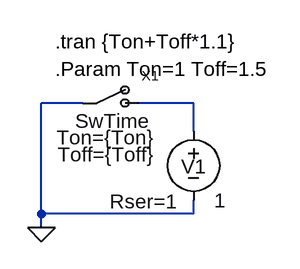
[diagram p0: schematic SwTimeJerTst.asc]
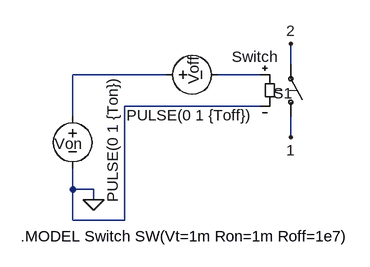
[diagram p1: sub-circuit swtime.asc]
SwTimeJerTst.asc, the LTspice schematic file:
Version 4
SHEET 1 880 680
WIRE 96 240 48 240
WIRE 224 240 160 240
WIRE 224 272 224 240
WIRE 48 368 48 240
WIRE 224 368 224 352
WIRE 224 368 48 368
WIRE 48 384 48 368
FLAG 48 384 0
SYMBOL voltage 224 256 R0
WINDOW 0 -14 57 Left 0
WINDOW 123 0 0 Left 0
WINDOW 39 -97 97 Left 0
SYMATTR InstName V1
SYMATTR SpiceLine Rser=1
SYMATTR Value 1
SYMBOL SwTime 128 240 R0
SYMATTR SpiceLine Ton={Ton}
SYMATTR SpiceLine2 Toff={Toff}
SYMATTR InstName X1
TEXT 64 168 Left 0 !.tran {Ton+Toff*1.1}
TEXT 64 200 Left 0 !.Param Ton=1 Toff=1.5

swtime.asc, the sub-circuit schematic file:
Version 4
SHEET 1 880 1444
WIRE 224 1152 224 1120
WIRE 32 1168 -112 1168
WIRE 176 1168 112 1168
WIRE 176 1216 -32 1216
WIRE -112 1232 -112 1168
WIRE 224 1264 224 1232
WIRE -112 1344 -112 1312
WIRE -80 1344 -112 1344
WIRE -80 1360 -80 1344
WIRE -112 1392 -112 1344
WIRE -32 1392 -32 1216
WIRE -32 1392 -112 1392
FLAG 224 1264 1
FLAG 224 1120 2
FLAG -80 1360 0
SYMBOL voltage -112 1216 R0
WINDOW 3 62 -45 VRight 0
WINDOW 123 0 0 Left 0
WINDOW 39 78 67 Left 0
WINDOW 0 -28 58 Left 0
SYMATTR Value PULSE(0 1 {Ton})
SYMATTR InstName Von
SYMBOL sw 224 1248 M180
WINDOW 0 -27 52 Left 0
WINDOW 3 -91 108 Left 0
SYMATTR InstName S1
SYMATTR Value Switch
SYMBOL voltage 16 1168 M90
WINDOW 3 62 -45 VRight 0
WINDOW 123 0 0 Left 0
WINDOW 39 78 67 Left 0
WINDOW 0 -28 58 Left 0
SYMATTR Value PULSE(0 1 {Toff})
SYMATTR InstName Voff
TEXT -192 1416 Left 0 !.MODEL Switch SW(Vt=1m Ron=1m Roff=1e7)

The netlist it stands for:
* SwTimeJerTst.asc
V1 N001 0 1 Rser=1
XX1 0 N001 swtime params: SwTime Ton={Ton} Toff={Toff}

* block symbol definitions
.subckt swtime 1 2
Von N001 0 PULSE(0 1 {Ton})
S1 1 2 N002 0 Switch
Voff N001 N002 PULSE(0 1 {Toff})
.MODEL Switch SW(Vt=1m Ron=1m Roff=1e7)
.ends swtime

.tran {Ton+Toff*1.1}
.Param Ton=1 Toff=1.5
.backanno
.end